# EAGLE schematic PCB_1 (EAGLE 7.6.0)
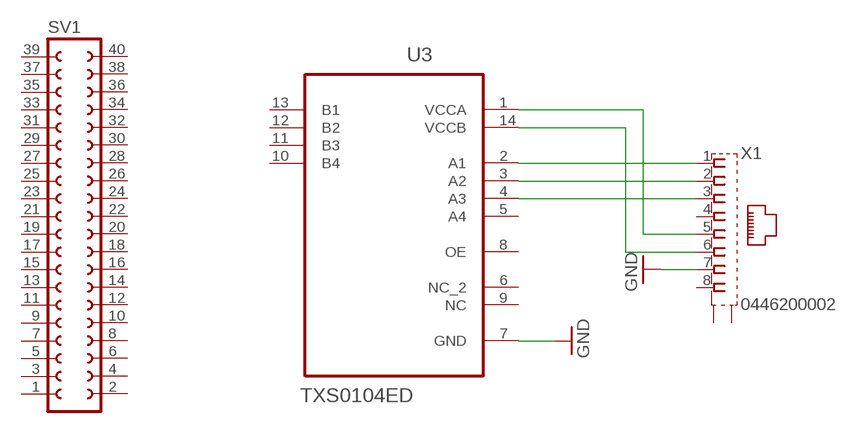
[diagram p0: schematic, sheet 1]

## Parts
SV1  FE20-2  [FE20-2]
U3  TXS0104ED  [SOIC127P600X175-14N]
X1  0446200002  [0446200002]

## Nets
GND: U3.7(GND) X1.7
N$1: U3.2(A1) X1.1
N$2: U3.3(A2) X1.2
N$3: U3.4(A3) X1.3
N$4: U3.1(VCCA) X1.5
N$5: U3.14(VCCB) X1.6
Unconnected: SV1.1 SV1.2 SV1.3 SV1.4 SV1.5 SV1.6 SV1.7 SV1.8 SV1.9 SV1.10 SV1.11 SV1.12 SV1.13 SV1.14 SV1.15 SV1.16 SV1.17 SV1.18 SV1.19 SV1.20 SV1.21 SV1.22 SV1.23 SV1.24 SV1.25 SV1.26 SV1.27 SV1.28 SV1.29 SV1.30 SV1.31 SV1.32 SV1.33 SV1.34 SV1.35 SV1.36 SV1.37 SV1.38 SV1.39 SV1.40 U3.5(A4) U3.6(NC_2) U3.8(OE) U3.9(NC) U3.10(B4) U3.11(B3) U3.12(B2) U3.13(B1) X1.4 X1.8 X1.S@1(S1) X1.S@2(S2)

## Library data of the parts
SV1 = con-lsta:FE20-2: FEMALE HEADER; OC_FARNELL: unknown; OC_NEWARK: unknown
U3 = TXS0104ED:TXS0104ED: 4-BIT BIDIRECTIONAL VOLTAGE-LEVEL TRANSLATOR FOR OPEN-DRAIN AND PUSH-PULL APPLICATIONS; AVAILABILITY: Unavailable; DESCRIPTION: 4-Bit Bidirectional Voltage-Level Shifter for Open-Drain and Push-Pull Applications 14-SOIC -40 to 85; MF: Texas Instruments; MP: TXS0104ED; PACKAGE: SOIC-14 Texas Instruments; PRICE: None
X1 = 0446200002:0446200002: RJ-45 INVERTED MODULAR JACK ASSEMBLY WITH RJ-11 KEEPOUT FEATURE Source: Data sheet <http://www.farnell.com/datasheets/73207.pdf> MOLEX 0446200002 BUCHSE, RJ45, GESCHIRMT Source: Farnell <http://de.farnell.com/molex/0446200002/buchse-rj45-geschirmt/dp/9251910?ost=9251910>; AVAILABILITY: Unavailable; DESCRIPTION: Conn RJ-45 RCP 8 POS 2.04mm Solder RA Thru-Hole 8 Terminal 1 Port Tray Cat 3; MF: Molex, LLC; MP: 0446200002; PACKAGE: None; PRICE: None